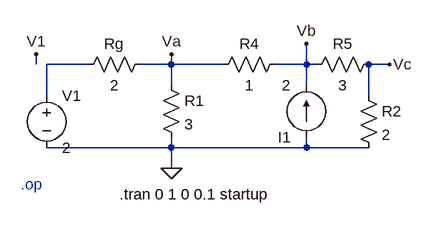
[diagram p0: schematic Draft1.asc]
Draft1.asc, the LTspice schematic file:
Version 4.1
SHEET 1 880 680
WIRE 80 48 80 32
WIRE 160 48 96 48
WIRE 288 48 288 32
WIRE 288 48 240 48
WIRE 368 48 288 48
WIRE 496 48 496 16
WIRE 496 48 448 48
WIRE 512 48 496 48
WIRE 624 48 592 48
WIRE 288 80 288 48
WIRE 496 80 496 48
WIRE 96 96 96 48
WIRE 592 96 592 48
WIRE 288 176 288 160
WIRE 288 176 96 176
WIRE 496 176 496 160
WIRE 496 176 288 176
WIRE 592 176 496 176
WIRE 288 208 288 176
FLAG 288 208 0
FLAG 288 32 Va
FLAG 624 48 Vc
FLAG 496 16 Vb
FLAG 80 32 V1
SYMBOL voltage 96 80 R0
WINDOW 123 0 0 Left 0
WINDOW 39 0 0 Left 0
SYMATTR InstName V1
SYMATTR Value 2
SYMBOL res 256 32 R90
WINDOW 0 0 56 VBottom 2
WINDOW 3 32 56 VTop 2
SYMATTR InstName Rg
SYMATTR Value 2
SYMBOL res 272 64 R0
SYMATTR InstName R1
SYMATTR Value 3
SYMBOL res 464 32 R90
WINDOW 0 0 56 VBottom 2
WINDOW 3 32 56 VTop 2
SYMATTR InstName R4
SYMATTR Value 1
SYMBOL res 608 32 R90
WINDOW 0 0 56 VBottom 2
WINDOW 3 32 56 VTop 2
SYMATTR InstName R5
SYMATTR Value 3
SYMBOL res 576 80 R0
SYMATTR InstName R2
SYMATTR Value 2
SYMBOL current 496 160 R180
WINDOW 123 0 0 Left 0
WINDOW 39 0 0 Left 0
SYMATTR InstName I1
SYMATTR Value 2
TEXT 56 232 Left 2 ;.op
TEXT 208 248 Left 2 !.tran 0 1 0 0.1 startup

The netlist it stands for:
* Draft1.asc
V1 N001 0 2
Rg Va N001 2
R1 Va 0 3
R4 Vb Va 1
R5 Vc Vb 3
R2 Vc 0 2
I1 0 Vb 2
* .op
.tran 0 1 0 0.1 startup
.backanno
.end

* Results of the author's LTspice run, read from the files saved beside the schematic
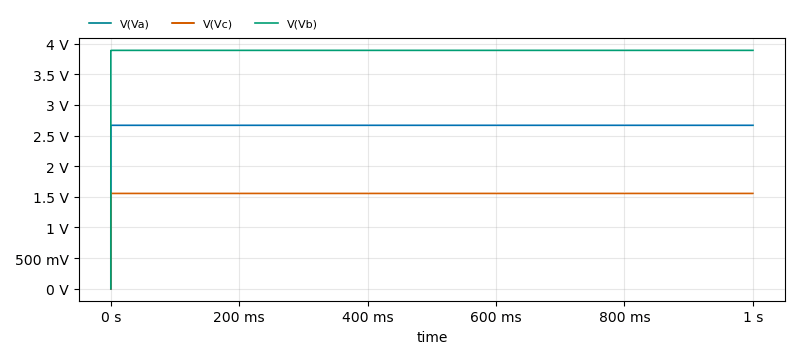
[diagram p1: Transient Analysis of Draft1.asc, plotted from the saved traces]
* Transient Analysis, 1 run:
*   V(Va): min 0 V, max 2.667 V, average 2.667 V, rms 2.667 V, last 2.667 V
*   V(Vc): min 0 V, max 1.556 V, average 1.556 V, rms 1.556 V, last 1.556 V
*   V(Vb): min 0 V, max 3.889 V, average 3.889 V, rms 3.889 V, last 3.889 V